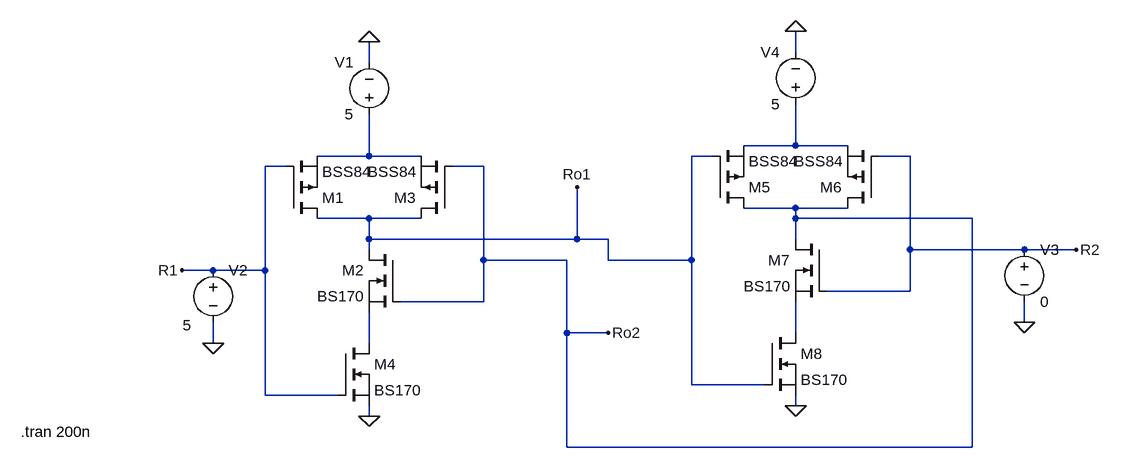
[diagram p0: schematic choosing_circuit.asc]
choosing_circuit.asc, the LTspice schematic file:
Version 4.1
SHEET 1 1728 680
WIRE 736 -80 736 -112
WIRE 80 -64 80 -96
WIRE 736 64 736 0
WIRE 736 64 656 64
WIRE 816 64 736 64
WIRE 80 80 80 16
WIRE 80 80 0 80
WIRE 160 80 80 80
WIRE 608 80 576 80
WIRE 912 80 864 80
WIRE -48 96 -80 96
WIRE 256 96 208 96
WIRE 736 160 656 160
WIRE 816 160 736 160
WIRE 80 176 0 176
WIRE 160 176 80 176
WIRE 736 176 736 160
WIRE 1008 176 736 176
WIRE 80 208 80 176
WIRE 400 208 400 128
WIRE 400 208 80 208
WIRE 448 208 400 208
WIRE 736 208 736 176
WIRE 80 224 80 208
WIRE 912 224 912 80
WIRE 1088 224 912 224
WIRE 1168 224 1088 224
WIRE 256 240 256 96
WIRE 384 240 256 240
WIRE 448 240 448 208
WIRE 576 240 576 80
WIRE 576 240 448 240
WIRE -160 256 -208 256
WIRE -80 256 -80 96
WIRE -80 256 -160 256
WIRE 912 288 912 224
WIRE 912 288 784 288
WIRE 256 304 256 240
WIRE 256 304 128 304
WIRE 1088 336 1088 304
WIRE 384 352 384 240
WIRE 448 352 384 352
WIRE 736 352 736 304
WIRE -160 368 -160 336
WIRE 80 368 80 320
WIRE 576 432 576 240
WIRE 688 432 576 432
WIRE -80 448 -80 256
WIRE 32 448 -80 448
WIRE 736 464 736 448
WIRE 80 480 80 464
WIRE 384 528 384 352
WIRE 1008 528 1008 176
WIRE 1008 528 384 528
FLAG 80 -96 0
FLAG 80 480 0
FLAG -208 256 R1
FLAG 736 -112 0
FLAG 736 464 0
FLAG 1168 224 R2
FLAG -160 368 0
FLAG 1088 336 0
FLAG 400 128 Ro1
FLAG 448 352 Ro2
SYMBOL pmos -48 176 M180
SYMATTR InstName M1
SYMATTR Value BSS84
SYMBOL pmos 208 176 R180
SYMATTR InstName M3
SYMATTR Value BSS84
SYMBOL voltage 80 32 R180
WINDOW 0 24 96 Left 2
WINDOW 3 24 16 Left 2
WINDOW 123 0 0 Left 0
WINDOW 39 0 0 Left 0
SYMATTR InstName V1
SYMATTR Value 5
SYMBOL nmos 128 224 M0
SYMATTR InstName M2
SYMATTR Value BS170
SYMBOL nmos 32 368 R0
SYMATTR InstName M4
SYMATTR Value BS170
SYMBOL pmos 608 160 M180
SYMATTR InstName M5
SYMATTR Value BSS84
SYMBOL pmos 864 160 R180
SYMATTR InstName M6
SYMATTR Value BSS84
SYMBOL voltage 736 16 R180
WINDOW 0 24 96 Left 2
WINDOW 3 24 16 Left 2
WINDOW 123 0 0 Left 0
WINDOW 39 0 0 Left 0
SYMATTR InstName V4
SYMATTR Value 5
SYMBOL nmos 784 208 M0
SYMATTR InstName M7
SYMATTR Value BS170
SYMBOL nmos 688 352 R0
SYMATTR InstName M8
SYMATTR Value BS170
SYMBOL voltage -160 240 R0
WINDOW 3 -47 100 Left 2
WINDOW 123 0 0 Left 0
WINDOW 39 0 0 Left 0
SYMATTR Value 5
SYMATTR InstName V2
SYMBOL voltage 1088 208 R0
WINDOW 123 0 0 Left 0
WINDOW 39 0 0 Left 0
SYMATTR InstName V3
SYMATTR Value 0
TEXT -456 504 Left 2 !.tran 200n

The netlist it stands for:
* choosing_circuit.asc
M1 Ro1 R1 N002 N002 BSS84
M3 Ro1 Ro2 N002 N002 BSS84
V1 N002 0 5
M2 Ro1 Ro2 N004 N004 BS170
M4 N004 R1 0 0 BS170
M5 Ro2 Ro1 N001 N001 BSS84
M6 Ro2 R2 N001 N001 BSS84
V4 N001 0 5
M7 Ro2 R2 N003 N003 BS170
M8 N003 Ro1 0 0 BS170
V2 R1 0 5
V3 R2 0 0
.model NMOS NMOS
.model PMOS PMOS
.lib standard.mos
.tran 200n
.backanno
.end